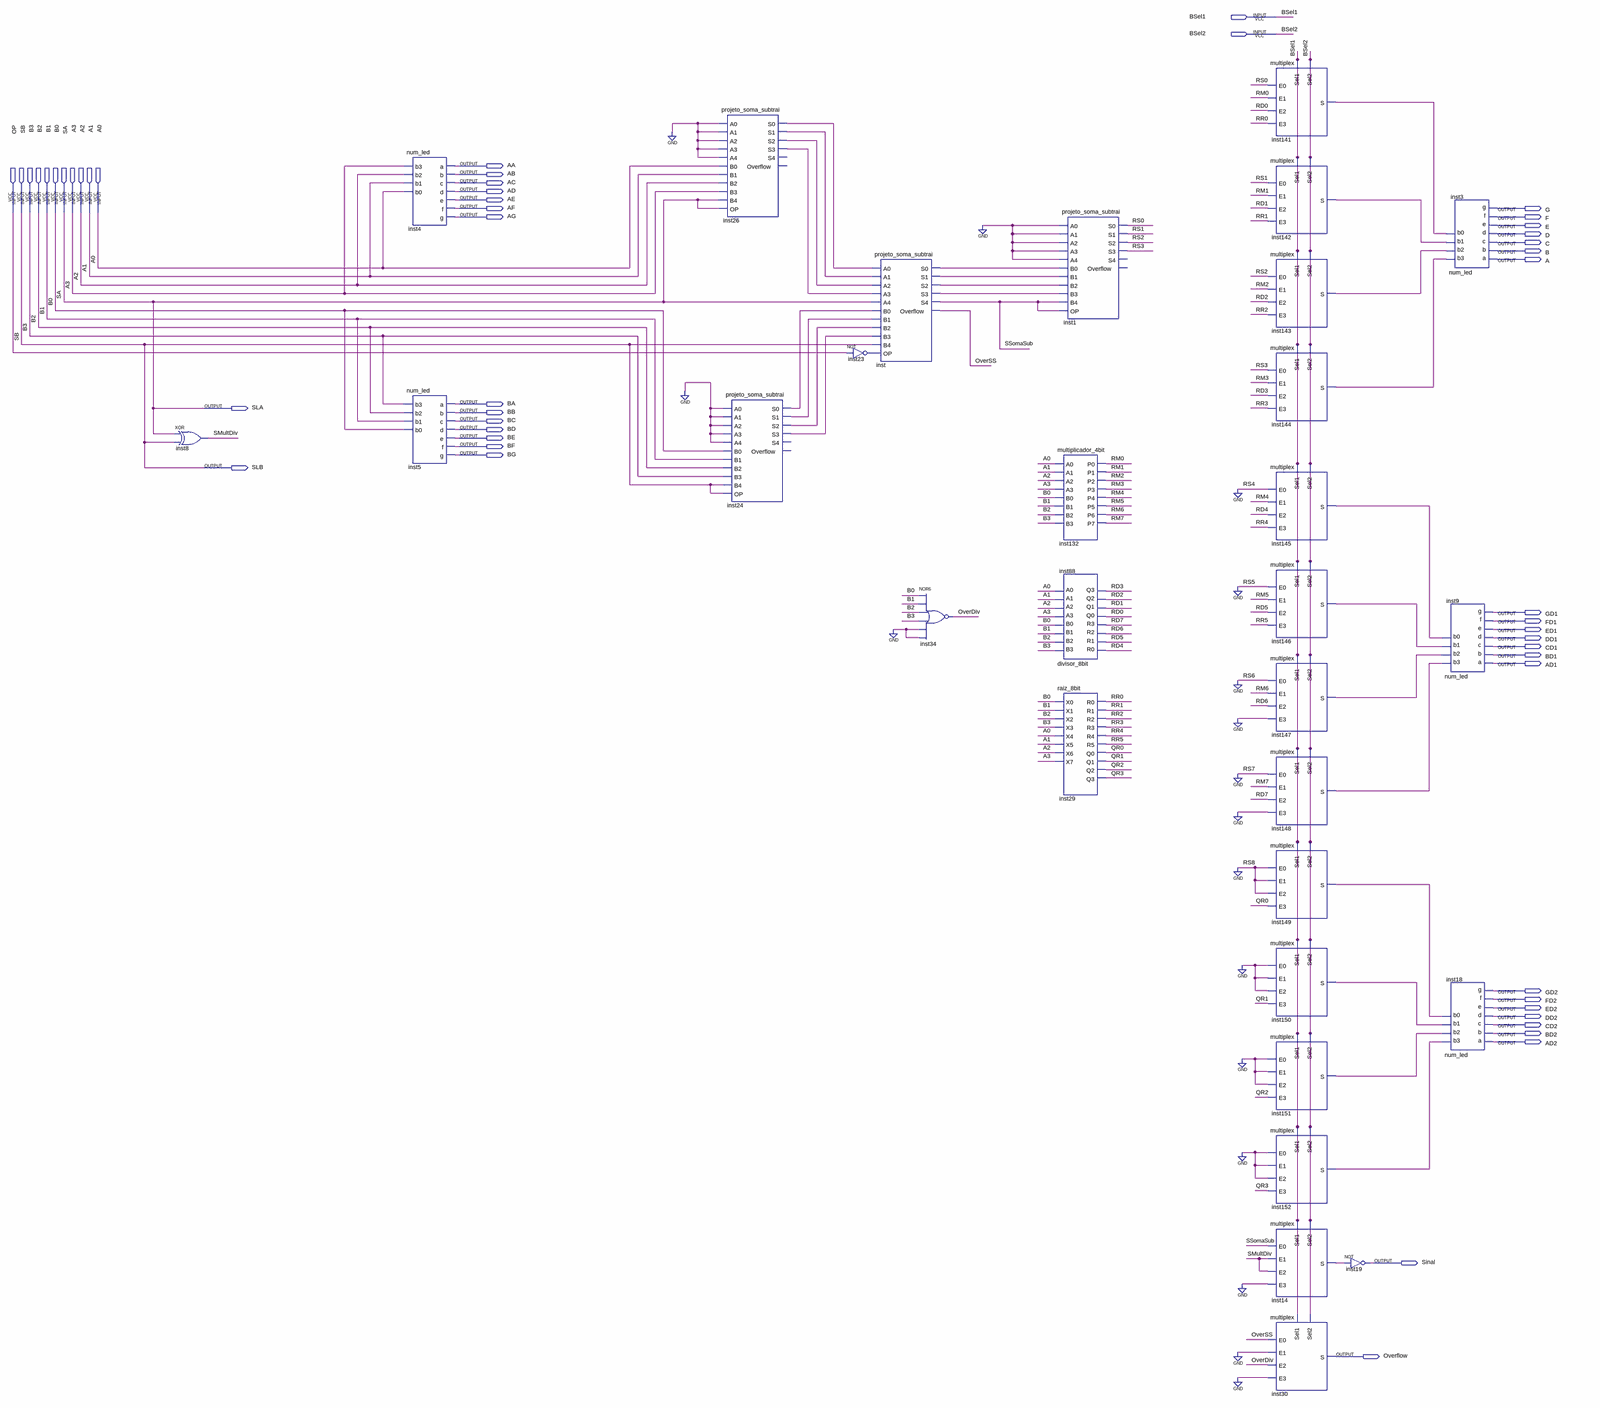
[diagram p0: schematic sheet, whole]
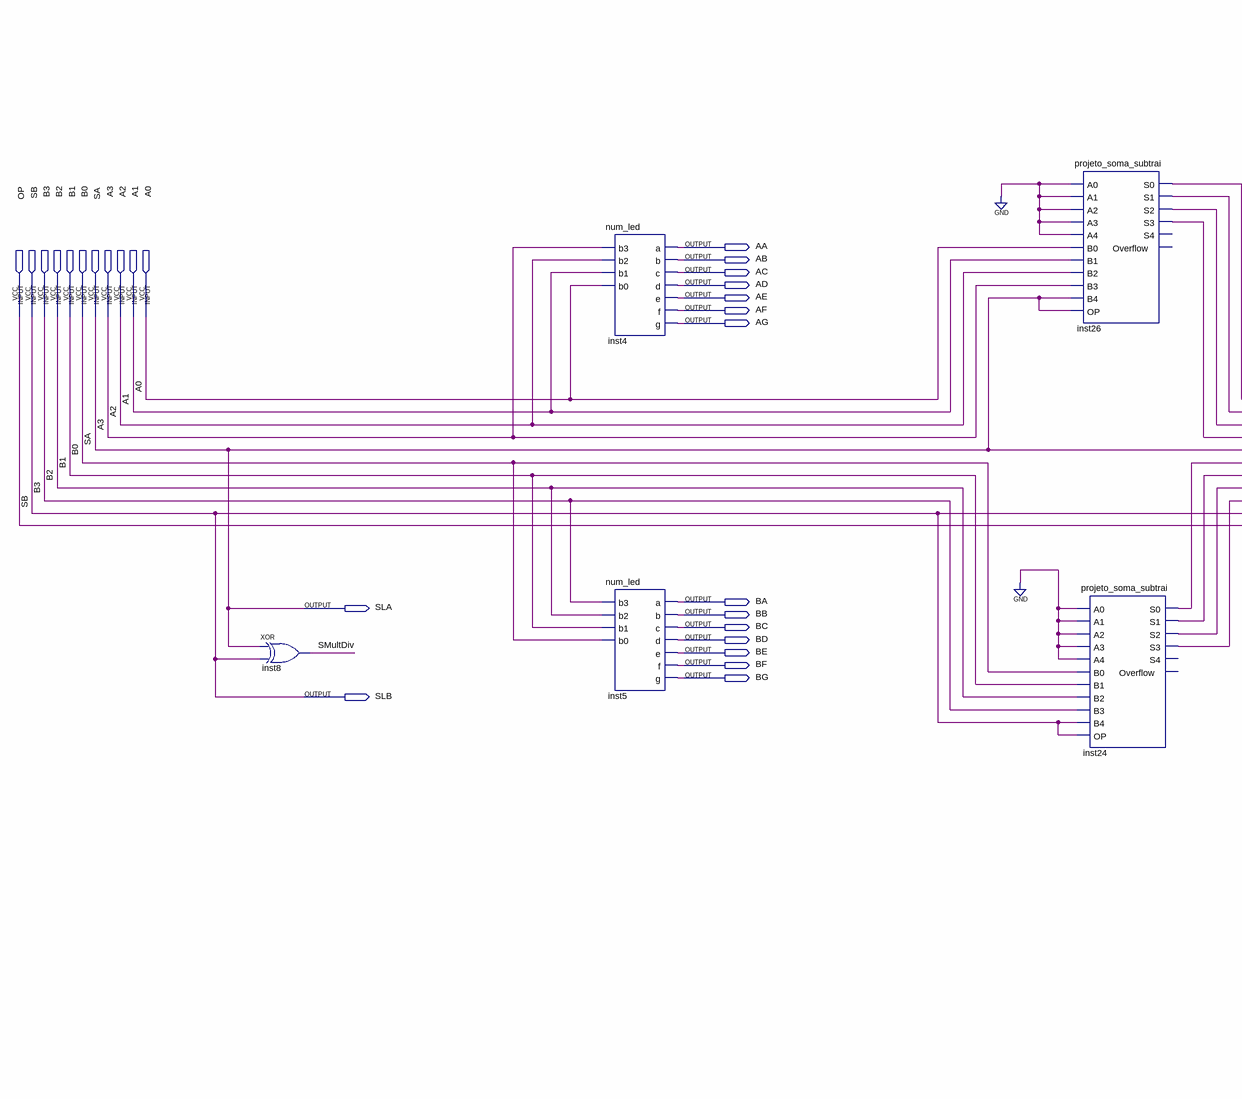
[diagram p1: schematic sheet, upper left part]
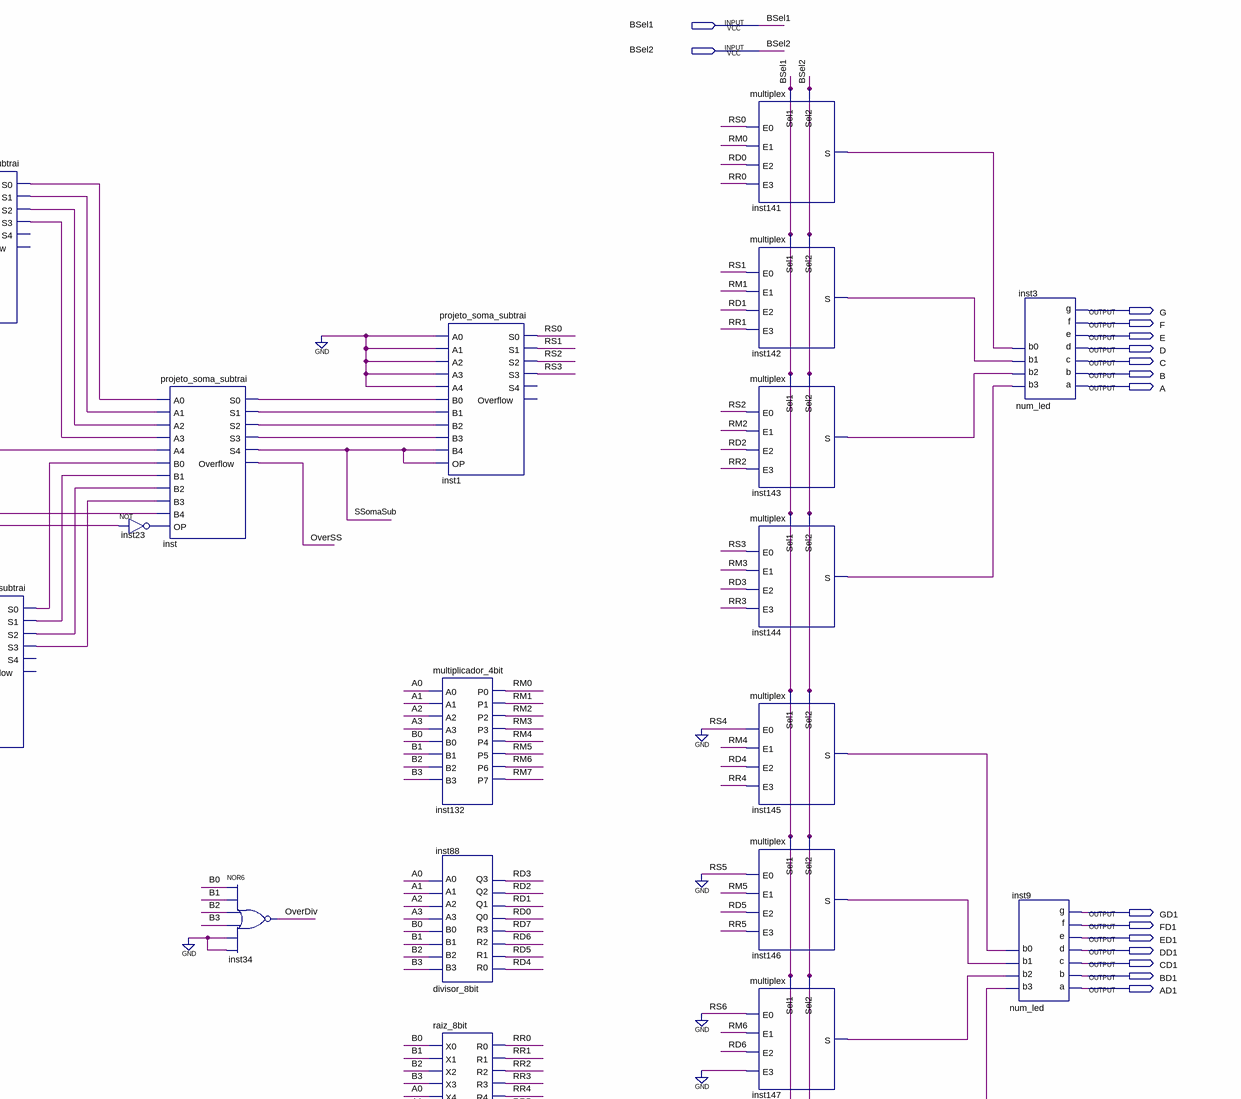
[diagram p2: schematic sheet, upper right part]
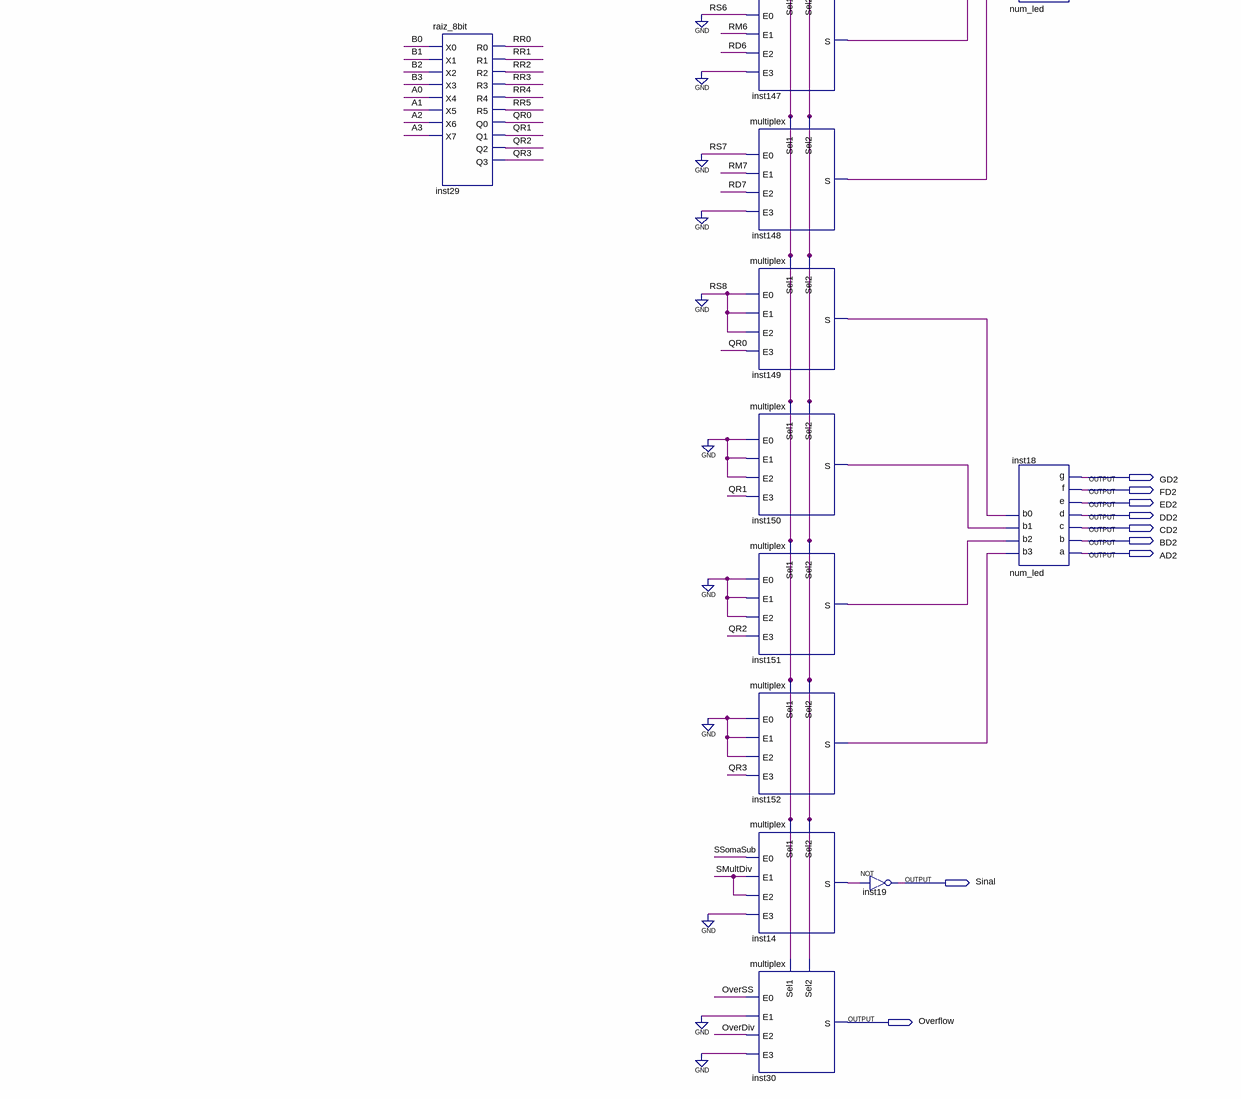
[diagram p3: schematic sheet, lower right part]
// Quartus schematic projeto_ULA.bdf as structural Verilog: 30 symbols, 52 pins
module projeto_ULA (
  input  BSel1,
  input  BSel2,
  input  OP,
  input  SB,
  input  B3,
  input  B2,
  input  B1,
  input  B0,
  input  SA,
  input  A3,
  input  A2,
  input  A1,
  input  A0,
  output AA,
  output AB,
  output AC,
  output AD,
  output AE,
  output AF,
  output G,
  output AG,
  output F,
  output E,
  output D,
  output C,
  output B,
  output A,
  output BA,
  output SLA,
  output BB,
  output BC,
  output BD,
  output BE,
  output BF,
  output BG,
  output SLB,
  output GD1,
  output FD1,
  output ED1,
  output DD1,
  output CD1,
  output BD1,
  output AD1,
  output GD2,
  output FD2,
  output ED2,
  output DD2,
  output CD2,
  output BD2,
  output AD2,
  output Sinal,
  output Overflow
);

  wire inst14_s, inst23_out, inst24_s0, inst24_s1, inst24_s2, inst24_s3, inst26_s0, inst26_s1, inst26_s2,
       inst26_s3, inst141_s, inst142_s, inst143_s, inst144_s, inst145_s, inst146_s, inst147_s, inst148_s,
       inst149_s, inst150_s, inst151_s, inst152_s, inst_s0, inst_s1, inst_s2, inst_s3, OverDiv, OverSS, QR0,
       QR1, QR2, QR3, RD0, RD1, RD2, RD3, RD4, RD5, RD6, RD7, RM0, RM1, RM2, RM3, RM4, RM5, RM6, RM7, RR0,
       RR1, RR2, RR3, RR4, RR5, RS0, RS1, RS2, RS3, SMultDiv, SSomaSub;

  xor inst8 (SMultDiv, SA, SB);
  num_led inst4 (.b3(A3), .b2(A2), .b1(A1), .b0(A0), .a(AA), .b(AB), .c(AC), .d(AD), .e(AE), .f(AF), .g(AG));
  num_led inst5 (.b3(B3), .b2(B2), .b1(B1), .b0(B0), .a(BA), .b(BB), .c(BC), .d(BD), .e(BE), .f(BF), .g(BG));
  projeto_soma_subtrai inst26 (
    .A0(1'b0), .A1(1'b0), .A2(1'b0), .A3(1'b0), .A4(1'b0), .B0(A0), .B1(A1), .B2(A2), .B3(A3), .B4(SA),
    .OP(SA), .S0(inst26_s0), .S1(inst26_s1), .S2(inst26_s2), .S3(inst26_s3));  // open: S4, Overflow
  projeto_soma_subtrai inst24 (
    .A0(1'b0), .A1(1'b0), .A2(1'b0), .A3(1'b0), .A4(1'b0), .B0(B0), .B1(B1), .B2(B2), .B3(B3), .B4(SB),
    .OP(SB), .S0(inst24_s0), .S1(inst24_s1), .S2(inst24_s2), .S3(inst24_s3));  // open: S4, Overflow
  not inst23 (inst23_out, OP);
  projeto_soma_subtrai inst (
    .A0(inst26_s0), .A1(inst26_s1), .A2(inst26_s2), .A3(inst26_s3), .A4(SA), .B0(inst24_s0), .B1(inst24_s1),
    .B2(inst24_s2), .B3(inst24_s3), .B4(SB), .OP(inst23_out), .S0(inst_s0), .S1(inst_s1), .S2(inst_s2),
    .S3(inst_s3), .S4(SSomaSub), .Overflow(OverSS));
  nor inst34 (OverDiv, B0, B1, B2, B3, 1'b0, 1'b0);
  multiplicador_4bit inst132 (
    .A0(A0), .A1(A1), .A2(A2), .A3(A3), .B0(B0), .B1(B1), .B2(B2), .B3(B3), .P0(RM0), .P1(RM1), .P2(RM2),
    .P3(RM3), .P4(RM4), .P5(RM5), .P6(RM6), .P7(RM7));
  divisor_8bit inst88 (
    .B0(B0), .B1(B1), .B2(B2), .B3(B3), .A3(A3), .A2(A2), .A1(A1), .A0(A0), .R0(RD4), .R1(RD5), .R2(RD6),
    .R3(RD7), .Q0(RD0), .Q1(RD1), .Q2(RD2), .Q3(RD3));
  raiz_8bit inst29 (
    .X0(B0), .X1(B1), .X2(B2), .X3(B3), .X4(A0), .X5(A1), .X6(A2), .X7(A3), .R0(RR0), .R1(RR1), .R2(RR2),
    .R3(RR3), .R4(RR4), .R5(RR5), .Q0(QR0), .Q1(QR1), .Q2(QR2), .Q3(QR3));
  projeto_soma_subtrai inst1 (
    .A0(1'b0), .A1(1'b0), .A2(1'b0), .A3(1'b0), .A4(1'b0), .B0(inst_s0), .B1(inst_s1), .B2(inst_s2),
    .B3(inst_s3), .B4(SSomaSub), .OP(SSomaSub), .S0(RS0), .S1(RS1), .S2(RS2), .S3(RS3));  // open: S4, Overflow
  multiplex inst141 (.Sel1(BSel1), .Sel2(BSel2), .E0(RS0), .E1(RM0), .E2(RD0), .E3(RR0), .S(inst141_s));
  multiplex inst142 (.Sel1(BSel1), .Sel2(BSel2), .E0(RS1), .E1(RM1), .E2(RD1), .E3(RR1), .S(inst142_s));
  multiplex inst143 (.Sel1(BSel1), .Sel2(BSel2), .E0(RS2), .E1(RM2), .E2(RD2), .E3(RR2), .S(inst143_s));
  multiplex inst144 (.Sel1(BSel1), .Sel2(BSel2), .E0(RS3), .E1(RM3), .E2(RD3), .E3(RR3), .S(inst144_s));
  multiplex inst145 (.Sel1(BSel1), .Sel2(BSel2), .E0(1'b0), .E1(RM4), .E2(RD4), .E3(RR4), .S(inst145_s));
  multiplex inst146 (.Sel1(BSel1), .Sel2(BSel2), .E0(1'b0), .E1(RM5), .E2(RD5), .E3(RR5), .S(inst146_s));
  multiplex inst147 (.Sel1(BSel1), .Sel2(BSel2), .E0(1'b0), .E1(RM6), .E2(RD6), .E3(1'b0), .S(inst147_s));
  multiplex inst148 (.Sel1(BSel1), .Sel2(BSel2), .E0(1'b0), .E1(RM7), .E2(RD7), .E3(1'b0), .S(inst148_s));
  multiplex inst149 (.Sel1(BSel1), .Sel2(BSel2), .E0(1'b0), .E1(1'b0), .E2(1'b0), .E3(QR0), .S(inst149_s));
  multiplex inst150 (.Sel1(BSel1), .Sel2(BSel2), .E0(1'b0), .E1(1'b0), .E2(1'b0), .E3(QR1), .S(inst150_s));
  multiplex inst151 (.Sel1(BSel1), .Sel2(BSel2), .E0(1'b0), .E1(1'b0), .E2(1'b0), .E3(QR2), .S(inst151_s));
  multiplex inst152 (.Sel1(BSel1), .Sel2(BSel2), .E0(1'b0), .E1(1'b0), .E2(1'b0), .E3(QR3), .S(inst152_s));
  multiplex inst14 (.Sel1(BSel1), .Sel2(BSel2), .E0(SSomaSub), .E1(SMultDiv), .E2(SMultDiv), .E3(1'b0), .S(inst14_s));
  multiplex inst30 (.Sel1(BSel1), .Sel2(BSel2), .E0(OverSS), .E1(1'b0), .E2(OverDiv), .E3(1'b0), .S(Overflow));
  not inst19 (Sinal, inst14_s);
  num_led inst3 (
    .b3(inst144_s), .b2(inst143_s), .b1(inst142_s), .b0(inst141_s), .a(A), .b(B), .c(C), .d(D), .e(E), .f(F),
    .g(G));
  num_led inst9 (
    .b3(inst148_s), .b2(inst147_s), .b1(inst146_s), .b0(inst145_s), .a(AD1), .b(BD1), .c(CD1), .d(DD1),
    .e(ED1), .f(FD1), .g(GD1));
  num_led inst18 (
    .b3(inst152_s), .b2(inst151_s), .b1(inst150_s), .b0(inst149_s), .a(AD2), .b(BD2), .c(CD2), .d(DD2),
    .e(ED2), .f(FD2), .g(GD2));

  assign SLA = SA;
  assign SLB = SB;
endmodule
